# Altium project Mother_Board_SSL2018.PrjPcb
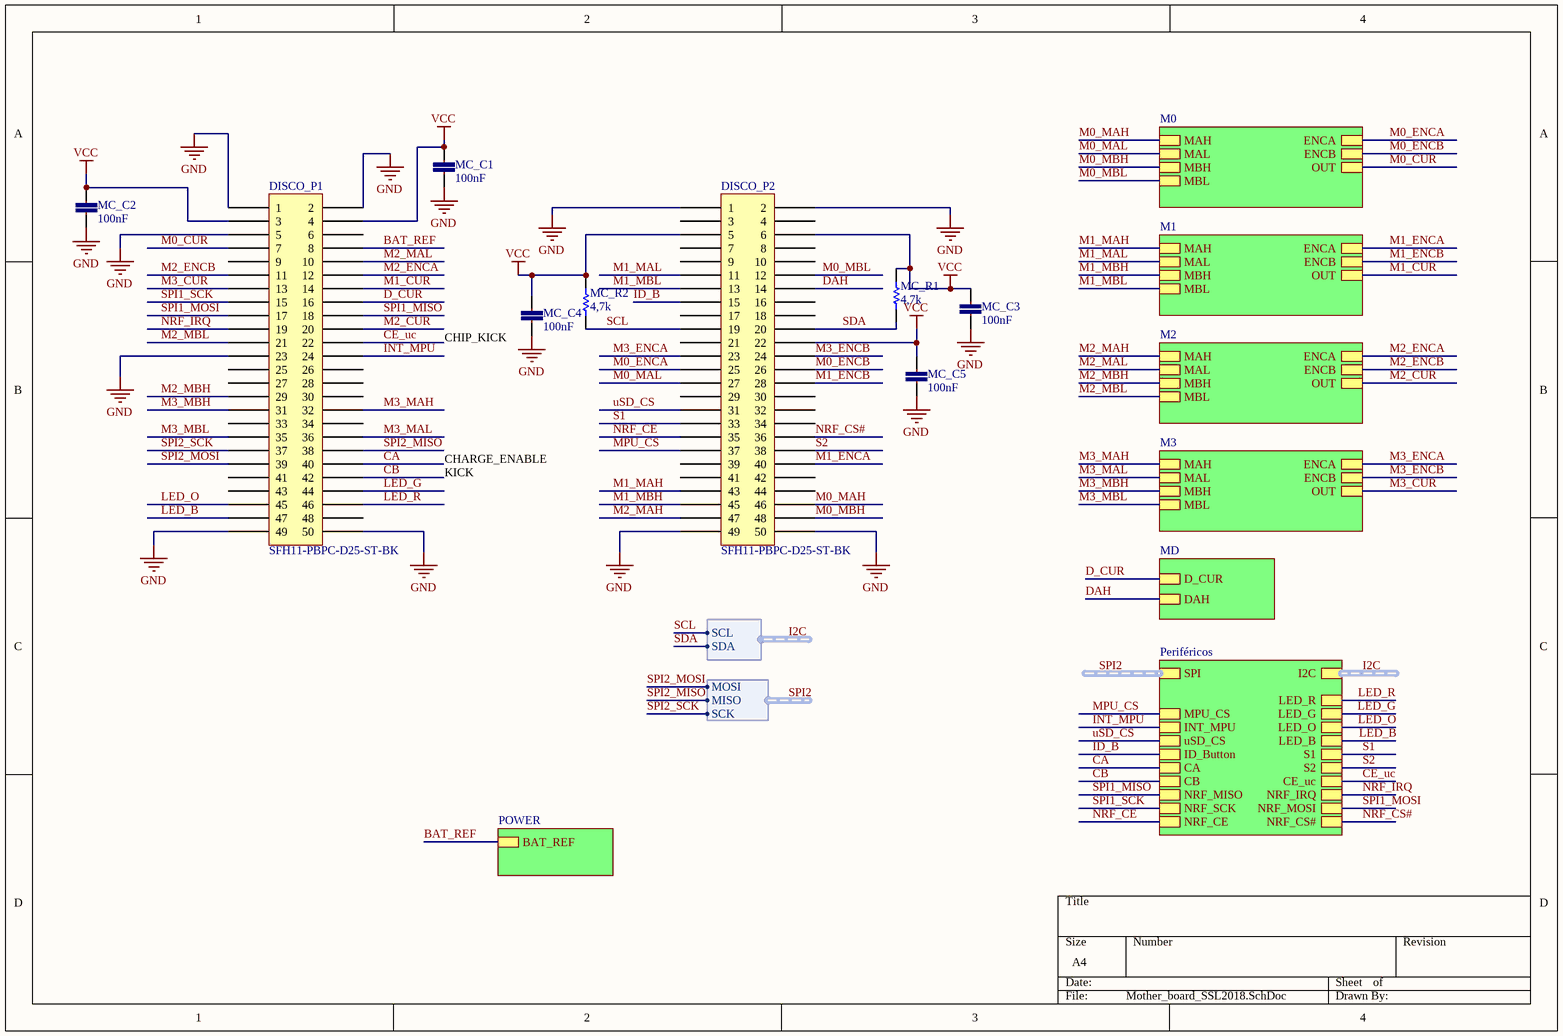
[diagram p0: Mother_board_SSL2018.SchDoc]
6 sheets, 106 parts. Net scope: hierarchical (ports join the sheet entries above them; power ports are global).
Board file: Mother_board_SSL2018.PcbDoc
Sheets:
  Mother_board_SSL2018.SchDoc
    M0 = MOTORES.SchDoc
    POWER = POWER.SchDoc
    M1 = MOTORES.SchDoc
    M2 = MOTORES.SchDoc
    M3 = MOTORES.SchDoc
    Periféricos = Periféricos.SchDoc
    MD = DRIBLE.SchDoc
  INA220.SchDoc

## Sheet Mother_board_SSL2018.SchDoc
size A4

### Parts
DISCO_P1  SFH11-PBPC-D25-ST-BK  [25x02_Conector_Female]
DISCO_P2  SFH11-PBPC-D25-ST-BK  [25x02_Conector_Female]
MC_C1  100nF  [0402-CAP]
MC_C2  100nF  [0402-CAP]
MC_C3  100nF  [0402-CAP]
MC_C4  100nF  [0402-CAP]
MC_C5  100nF  [0402-CAP]
MC_R1  4,7k  [0402]
MC_R2  4,7k  [0402]

### Sub-sheets
M0 = MOTORES.SchDoc: MBH, MAH, MBL, MAL, ENCA, ENCB, OUT
M1 = MOTORES.SchDoc: MBH, MAH, MBL, MAL, ENCA, ENCB, OUT
M2 = MOTORES.SchDoc: MBH, MAH, MBL, MAL, ENCA, ENCB, OUT
M3 = MOTORES.SchDoc: MBH, MAH, MBL, MAL, ENCA, ENCB, OUT
MD = DRIBLE.SchDoc: D_CUR, DAH
Periféricos = Periféricos.SchDoc: MPU_CS, INT_MPU, uSD_CS, LED_R, LED_G, LED_O, LED_B, ID_Button, SPI (harness SPI), I2C (harness I2C), S1, S2, CA, CB, CE_uc, NRF_MISO, NRF_SCK, NRF_CE, NRF_IRQ, NRF_MOSI, NRF_CS#
POWER = POWER.SchDoc: BAT_REF

### Harnesses
I2C: SCL, SDA
SPI: MOSI, MISO, SCK

### Nets
GND: DISCO_P1.1 DISCO_P1.2 DISCO_P1.5 DISCO_P1.23 DISCO_P1.49 DISCO_P1.50 DISCO_P2.1 DISCO_P2.2 DISCO_P2.49 DISCO_P2.50 MC_C1.1 MC_C2.2 MC_C3.1 MC_C4.1 MC_C5.1
VCC: DISCO_P1.3 DISCO_P1.4 DISCO_P2.5 DISCO_P2.6 DISCO_P2.22 MC_C1.2 MC_C2.1 MC_C3.2 MC_C4.2 MC_C5.2 MC_R1.2 MC_R2.2
BAT_REF: DISCO_P1.8 ; sheet POWER/BAT_REF
CA: DISCO_P1.40 ; sheet Periféricos/CA
CB: DISCO_P1.42 ; sheet Periféricos/CB
CE_uc: DISCO_P1.22 ; sheet Periféricos/CE_uc
D_CUR: DISCO_P1.16 ; sheet MD/D_CUR
DAH: DISCO_P2.14 ; sheet MD/DAH
ID_B: DISCO_P2.15 ; sheet Periféricos/ID_Button
INT_MPU: DISCO_P1.24 ; sheet Periféricos/INT_MPU
LED_B: DISCO_P1.47 ; sheet Periféricos/LED_B  [project net Blue_led]
LED_G: DISCO_P1.44 ; sheet Periféricos/LED_G
LED_O: DISCO_P1.45 ; sheet Periféricos/LED_O
LED_R: DISCO_P1.46 ; sheet Periféricos/LED_R
M0_CUR: DISCO_P1.7 ; sheet M0/OUT
M0_ENCA: DISCO_P2.25 ; sheet M0/ENCA
M0_ENCB: DISCO_P2.26 ; sheet M0/ENCB
M0_MAH: DISCO_P2.46 ; sheet M0/MAH
M0_MAL: DISCO_P2.27 ; sheet M0/MAL
M0_MBH: DISCO_P2.48 ; sheet M0/MBH
M0_MBL: DISCO_P2.12 ; sheet M0/MBL
M1_CUR: DISCO_P1.14 ; sheet M1/OUT
M1_ENCA: DISCO_P2.40 ; sheet M1/ENCA
M1_ENCB: DISCO_P2.28 ; sheet M1/ENCB
M1_MAH: DISCO_P2.43 ; sheet M1/MAH
M1_MAL: DISCO_P2.11 ; sheet M1/MAL
M1_MBH: DISCO_P2.45 ; sheet M1/MBH
M1_MBL: DISCO_P2.13 ; sheet M1/MBL
M2_CUR: DISCO_P1.20 ; sheet M2/OUT
M2_ENCA: DISCO_P1.12 ; sheet M2/ENCA
M2_ENCB: DISCO_P1.11 ; sheet M2/ENCB
M2_MAH: DISCO_P2.47 ; sheet M2/MAH
M2_MAL: DISCO_P1.10 ; sheet M2/MAL
M2_MBH: DISCO_P1.29 ; sheet M2/MBH
M2_MBL: DISCO_P1.21 ; sheet M2/MBL
M3_CUR: DISCO_P1.13 ; sheet M3/OUT
M3_ENCA: DISCO_P2.23 ; sheet M3/ENCA
M3_ENCB: DISCO_P2.24 ; sheet M3/ENCB
M3_MAH: DISCO_P1.32 ; sheet M3/MAH
M3_MAL: DISCO_P1.36 ; sheet M3/MAL
M3_MBH: DISCO_P1.31 ; sheet M3/MBH
M3_MBL: DISCO_P1.35 ; sheet M3/MBL
MPU_CS: DISCO_P2.37 ; sheet Periféricos/MPU_CS
NRF_CE: DISCO_P2.35 ; sheet Periféricos/NRF_CE
NRF_CS#: DISCO_P2.36 ; sheet Periféricos/NRF_CS#
NRF_IRQ: DISCO_P1.19 ; sheet Periféricos/NRF_IRQ
S1: DISCO_P2.33 ; sheet Periféricos/S1
S2: DISCO_P2.38 ; sheet Periféricos/S2
SCL: DISCO_P2.19 MC_R2.1 ; sheet Periféricos/I2C.SCL  [project net I2C.SCL]
SDA: DISCO_P2.20 MC_R1.1 ; sheet Periféricos/I2C.SDA  [project net I2C.SDA]
SPI1_MISO: DISCO_P1.18 ; sheet Periféricos/NRF_MISO
SPI1_MOSI: DISCO_P1.17 ; sheet Periféricos/NRF_MOSI
SPI1_SCK: DISCO_P1.15 ; sheet Periféricos/NRF_SCK
SPI2_MISO: DISCO_P1.38 ; sheet Periféricos/SPI.MISO  [project net SPI2.MISO]
SPI2_MOSI: DISCO_P1.39 ; sheet Periféricos/SPI.MOSI  [project net SPI2.MOSI]
SPI2_SCK: DISCO_P1.37 ; sheet Periféricos/SPI.SCK  [project net SPI2.SCK]
uSD_CS: DISCO_P2.31 ; sheet Periféricos/uSD_CS

Not connected (* = marked no-connect by the designer): DISCO_P1 6 9 25 26 27 28 30 33 34 41 43 48; DISCO_P2 3 4 7 8 9 10 16 17 18 21 29 30 32 34 39 41 42 44

### Buses and harness runs
harness I2C = sheet Periféricos/I2C
harness SPI2 = sheet Periféricos/SPI

### Notes on the sheet
- (near MC_C4) CHIP_KICK
- KICK
- CHARGE_ENABLE

### Library data of the parts
DISCO_P1 DISCO_P2 = 25x02_Conector_Female: 50 Position Header Connector 0.100" (2.54mm) Through Hole Gold
MC_C1-MC_C5 = CC0402-100nF-A.12: CAP CER 0.1UF 10V 20% X5R 0402; Part No: VJ0402V104ZXQPBC; Cod EMS: 05.281.006.133; Value: 100n
MC_R1 MC_R2 = Res1: Resistor; Published: 8-Jun-2000; LatestRevisionDate: 17-Jul-2002; LatestRevisionNote: Re-released for DXP Platform.; PackageReference: AXIAL-0.3; Publisher: Altium Limited; PackageDescription: Axial Device, Thru-Hole; 2 Leads; 0.3 in Pin Spacing; Value: 4,7K

## Sheet MOTORES.SchDoc
size A4
Used 4 times, as channels M0, M1, M2, M3. Parts and nets are listed once, with the designators drawn on the sheet.
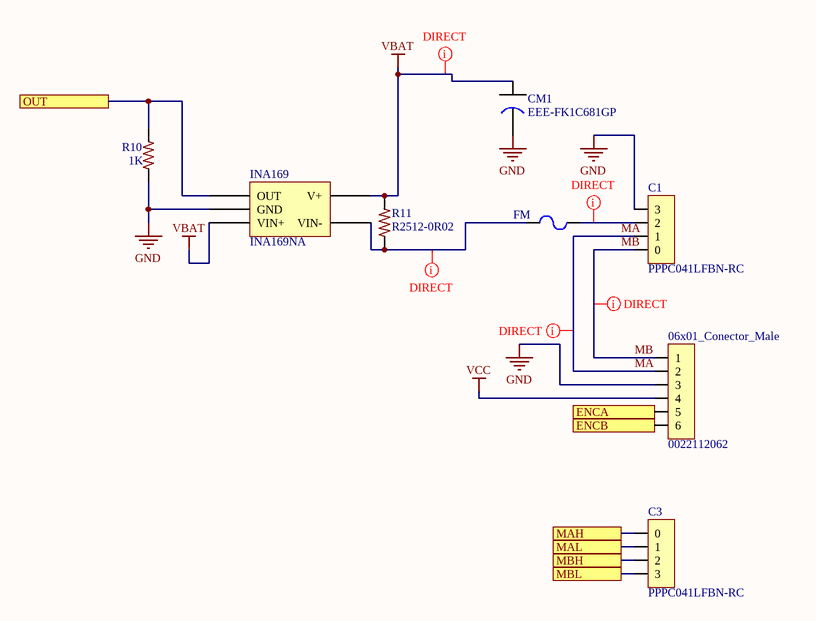
[diagram p1: MOTORES.SchDoc]

### Parts
06x01_Conector_Male  0022112062  [06x01_Conector_Male]
C1  PPPC041LFBN-RC  [04x01_Conector_Female]
C3  PPPC041LFBN-RC  [04x01_Conector_Female]
CM1  EEE-FK1C681GP  [EEE-FK1C681GP]
FM  MF-MSMF250/16X  [RESC4632X16N]  (value not drawn)
INA169  INA169NA  [SOT95P280X125-5N]
R10  1K  [0402-RES-HD]
R11  R2512-0R02  [2512-RES-HD]

### Ports
ENCA, ENCB, MAH, MAL, MBH, MBL, OUT

### Nets
GND: 06x01_Conector_Male.3 C1.3 CM1.2 INA169.2(GND) R10.1
VBAT: CM1.1 INA169.3(VIN+) INA169.4(V+) R11.2
VCC: 06x01_Conector_Male.4
ENCA: 06x01_Conector_Male.5 ; port ENCA
ENCB: 06x01_Conector_Male.6 ; port ENCB
MA: 06x01_Conector_Male.2 C1.1
MAH: C3.0 ; port MAH
MAL: C3.1 ; port MAL
MB: 06x01_Conector_Male.1 C1.0
MBH: C3.2 ; port MBH
MBL: C3.3 ; port MBL
OUT: INA169.1(OUT) R10.2 ; port OUT
NetC1_2: C1.2 FM.1
NetFM_2: FM.2 INA169.5(VIN-) R11.1

### Channels
M0: designators end in _M0; ports ENCA=M0_ENCA ENCB=M0_ENCB MAH=M0_MAH MAL=M0_MAL MBH=M0_MBH MBL=M0_MBL OUT=M0_CUR
M1: designators end in _M1; ports ENCA=M1_ENCA ENCB=M1_ENCB MAH=M1_MAH MAL=M1_MAL MBH=M1_MBH MBL=M1_MBL OUT=M1_CUR
M2: designators end in _M2; ports ENCA=M2_ENCA ENCB=M2_ENCB MAH=M2_MAH MAL=M2_MAL MBH=M2_MBH MBL=M2_MBL OUT=M2_CUR
M3: designators end in _M3; ports ENCA=M3_ENCA ENCB=M3_ENCB MAH=M3_MAH MAL=M3_MAL MBH=M3_MBH MBL=M3_MBL OUT=M3_CUR

### Layout directives
net class DIRECT: MA_M0, MB_M0, NetC1_M0_2, NetFM_M0_2, VBAT

### Library data of the parts
06x01_Conector_Male = 06x01_Conector_Male: CONN HEADER 6POS .100 VERT GOLD
C1 C3 = 04x01_Conector_Female-SCH: 4 Position Header Connector 0.100" (2.54mm) Through Hole Gold
CM1 = CAP AL 680UF/16V: Aluminum Electrolytic Capacitors - SMD Al Lytic Cap SMT FK Series 105C
FM = MF-MSMF250/16X-01.A.1: PTC RESETTABLE .30A 30V 1812
INA169 = INA169NA-01.A.1: IC CURRENT MONITOR 0.5% SOT23-5
R10 = R0402-1K-A.9: RES 1K OHM 1/10W 1% 0402 SMD; Part No: ERJ-2RKF1001X; Cod EMS: 05.280.029.527; Family Description: RESISTOR FILME ESPESSO 10R-1M / 1/10W / 1% / 0402. P/N: ERJ-2RKF....X – PANASONIC ELECTRONIC COMPONENTS.; Value: 1K; Family: ERJ-2RKF....X
R11 = R2512-0R02-4: RES .02 OHM 2W 1% 2512 SMD; Part No: WSL2512R0200FEA18; Cod EMS: 05.280.029.529; Value: 0.02; Family Description: RESISTOR SENTIDO DE CORRENTE 0,010R-0,040R/ 2W / 1% / 2512 P/N: WSL2512.....FEA18 – VISHAY DALE.; Family: WSL2512.....FEA18

## Sheet POWER.SchDoc
size A4
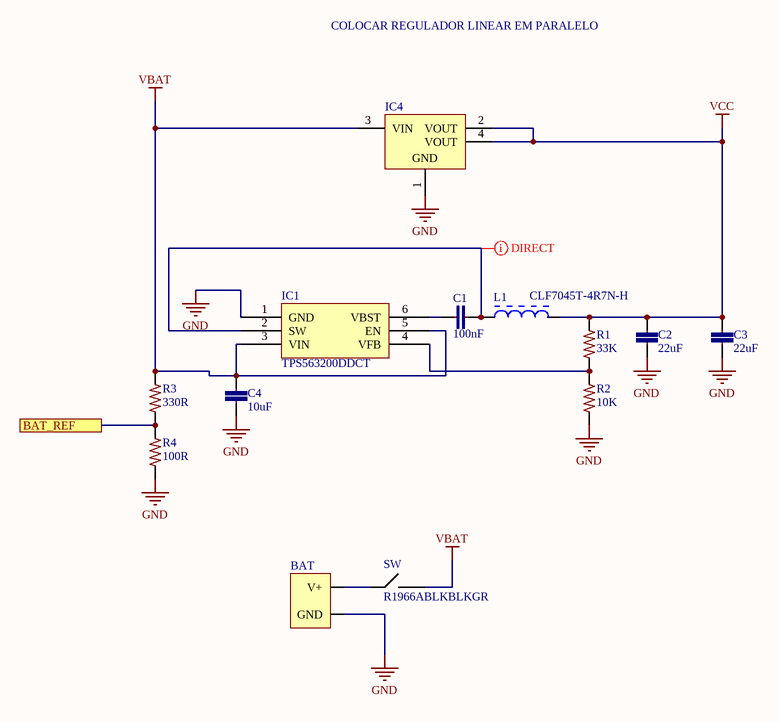
[diagram p2: POWER.SchDoc]

### Parts
(Parts that share a designator on the sheet are numbered #1, #2 ... from top to bottom, then left to right.)
BAT  XT60  [BATTERY_CONECTO-PCB]  (value not drawn)
C1#1  100nF  [0402-CAP]
C2#1  22uF  [1206-CAP]
C3  22uF  [1206-CAP]
C4  10uF  [1210-CAP]
IC1#1  TPS563200DDCT  [SOT95P280X110-6N]
IC4  LD1117S33CTR  [SOT-223_N]  (value not drawn)
L1  CLF7045T-4R7N-H  [CLF7045T]
R1#1  33K  [0402-RES-HD]
R2#1  10K  [0402-RES-HD]
R3#1  330R  [0402-RES-HD]
R4  100R  [0402-RES-HD]
SW  R1966ABLKBLKGR  [R1966AB-PCB]

### Ports
BAT_REF

### Nets
GND: BAT.1(GND) C2#1.1 C3.1 C4.1 IC1#1.1(GND) IC4.1(GND) R2#1.1 R4.1
VBAT: C4.2 IC1#1.3(VIN) IC1#1.5(EN) IC4.3(VIN) R3#1.2 SW.1
VCC: C2#1.2 C3.2 IC4.2(VOUT) IC4.4(VOUT) L1.2 R1#1.2
BAT_REF: R3#1.1 R4.2 ; port BAT_REF
NetBAT_0: BAT.0(V+) SW.0
NetC1#1_1: C1#1.1 IC1#1.6(VBST)
NetC1#1_2: C1#1.2 IC1#1.2(SW) L1.1
NetIC1#1_4: IC1#1.4(VFB) R1#1.1 R2#1.2

### Layout directives
net class DIRECT: NetC1#1_2

### Notes on the sheet
- COLOCAR REGULADOR LINEAR EM PARALELO

### Library data of the parts
BAT = BATTERY_CONNECTOR: XT60 PRT-10474
C1#1 = CC0402-100nF-50v-A.3: CAP CER 0.1UF 50V 10% X7R 0402; Part No: C1005X7R1H104K050BB; Value: 100n; Cod EMS: 05.281.019.021
C2#1 C3 = CC1206-22uF-6.3V-1: CAP CER 22UF 6.3V 20% X5R 1206; Part No: C3216X5R0J226M085AC; Value: 22u; Rule: UNIONINDEX{}0[]RULEKIND{}PolygonConnect[]NETSCOPE{}AnyNet[]LAYERKIND{}SameLayer[]NAME{}Schematic Polygon Connect Style[]CONNECTSTYLE{}Direct[]RELIEFCONDUCTORWIDTH{}10mil[]RELIEFENTRIES{}4[]POLYGONRELIEFANGLE{}45 Angle[]AIRGAPWIDTH{}10mil[]UNIT{}Imperial[]PcbType{}ProtelPcb
C4 = CC1210-10uF-6: CAP CER 10UF 50V 20% X5R 1210; Part No: UMK325BJ106MM; value: 10u; Cod EMS: 05.281.019.522
IC1#1 = TPS563200DDCT-01.A.2: IC REG BUCK ADJ 3A SYNC 6SOT
IC4 = CMP-0244-00307-1: Fixed Low Drop Positive Voltage Regulator, 3.3V, 4-Pin SOT-223, Tape and Reel; ComponentLink1URL: http://www.st.com; PackageVersion: 2010; ComponentLink1Description: Manufacturer URL; DatasheetVersion: 1/11/2011; ComponentLink2URL: http://www.st.com/internet/com/TECHNICAL_RESOURCES/TECHNICAL_LITERATURE/DATASHEET/CD00000544.pdf; PackageReference: SOT-223; ComponentLink2Description: Datasheet; PackageDescription: 4-Pin SOT-223 Package, 6.5 x 3.5 mm Body, 2.3 mm Pitch, 7 mm Lead Span
L1 = CLF7045T-4R7N-H-2: FIXED IND 4.7UH 4.1A 20 MOHM SMD; Family Description: INDUTORES FIXOS 7,2x6,9mm TDK CLF7045T -45 A 125oC; Rule: UNIONINDEX{}0[]RULEKIND{}PolygonConnect[]NETSCOPE{}AnyNet[]LAYERKIND{}SameLayer[]NAME{}Schematic Polygon Connect Style[]CONNECTSTYLE{}Direct[]RELIEFCONDUCTORWIDTH{}10mil[]RELIEFENTRIES{}4[]POLYGONRELIEFANGLE{}45 Angle[]AIRGAPWIDTH{}10mil[]UNIT{}Imperial[]PcbType{}ProtelPcb; Part No: CLF7045T-4R7N-H; Family: CLF7045T
R1#1 = R0402-33K-7: RES 33K OHM 1/10W 1% 0402 SMD; Part No: ERJ-2RKF3302X; Family Description: RESISTOR FILME ESPESSO 10R-1M / 1/10W / 1% / 0402. P/N: ERJ-2RKF....X – PANASONIC ELECTRONIC COMPONENTS.; Cod EMS: 05.280.029.535; Value: 33K; Family: ERJ-2RKF....X
R2#1 = R0402-10K-10: RES 10K OHM 1/10W 1% 0402 SMD; Part No: ERJ-2RKF1002X; Cod EMS: 05.280.029.525; Family Description: RESISTOR FILME ESPESSO 10R-1M / 1/10W / 1% / 0402. P/N: ERJ-2RKF....X – PANASONIC ELECTRONIC COMPONENTS.; Value: 10K; Family: ERJ-2RKF....X
R3#1 = R0402-10K-10: RES 330R OHM 1/10W 1% 0402 SMD; Part No: ERJ-2RKF1002X; Cod EMS: 05.280.029.525; Value: 330; Family Description: RESISTOR FILME ESPESSO 10R-1M / 1/10W / 1% / 0402. P/N: ERJ-2RKF....X – PANASONIC ELECTRONIC COMPONENTS.; Family: ERJ-2RKF....X
R4 = R0402-33K-7: RES 100R OHM 1/10W 1% 0402 SMD; Part No: ERJ-2RKF3302X; Cod EMS: 05.280.029.535; Value: 100; Family Description: RESISTOR FILME ESPESSO 10R-1M / 1/10W / 1% / 0402. P/N: ERJ-2RKF....X – PANASONIC ELECTRONIC COMPONENTS.; Family: ERJ-2RKF....X
SW = Rocker Switch: SWITCH ROCKER SPST 15A 125V

## Sheet Periféricos.SchDoc
size A4
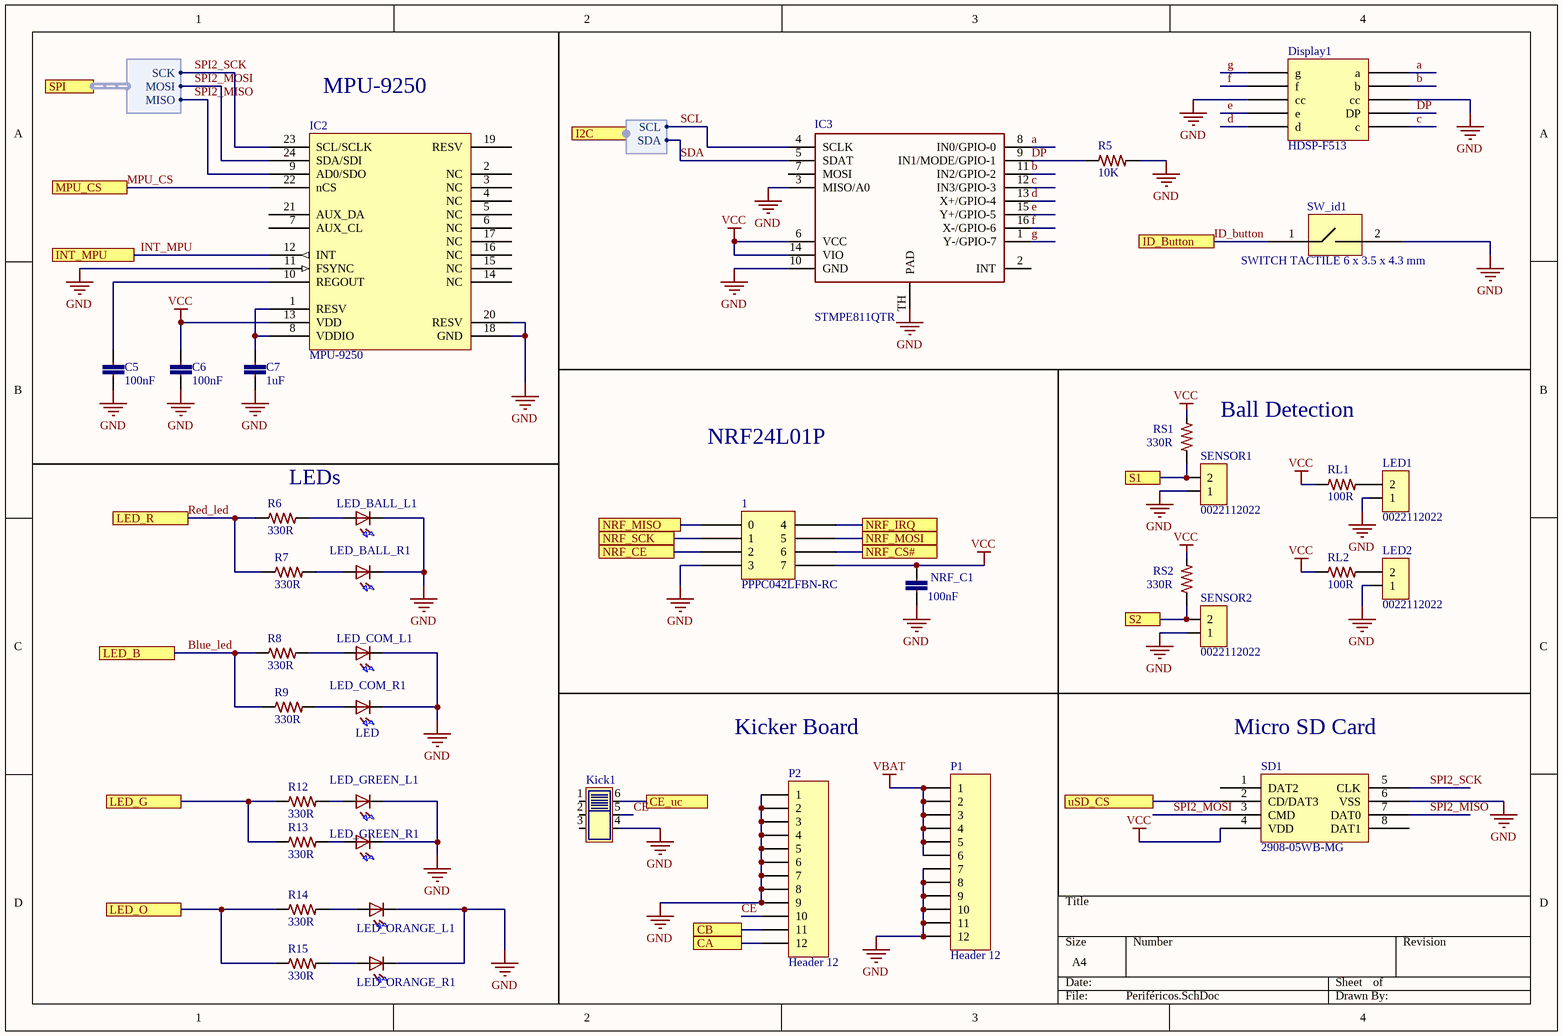
[diagram p3: Periféricos.SchDoc]

### Parts
1  PPPC042LFBN-RC  [04x02_Conector_Female]
C5  100nF  [0402-CAP]
C6  100nF  [0402-CAP]
C7  1uF  [0402-CAP]
Display1  HDSP-F513  [New footprint 1]
IC2  MPU-9250  [MPU-9250]
IC3  STMPE811QTR  [QFN16_N]
Kick1  JS202011SCQN  [SOP250P750X350-6N]  (value not drawn)
LED1  0022112022  [02x01_Conector_Male]
LED2  0022112022  [02x01_Conector_Male]
LED_BALL_L1  LED  [LED-5MM-PCB]  (value not drawn)
LED_BALL_R1  LED  [LED-5MM-PCB]  (value not drawn)
LED_COM_L1  LED  [LED-5MM-PCB]  (value not drawn)
LED_COM_R1  LED  [LED-5MM-PCB]
LED_GREEN_L1  LED  [LED-5MM-PCB]  (value not drawn)
LED_GREEN_R1  LED  [LED-5MM-PCB]  (value not drawn)
LED_ORANGE_L1  LED  [LED-5MM-PCB]  (value not drawn)
LED_ORANGE_R1  LED  [LED-5MM-PCB]  (value not drawn)
NRF_C1  100nF  [0402-CAP]
P1  Header 12  [HDR1X12]
P2  Header 12  [HDR1X12]
R5  10K  [0402-RES-HD]
R6  330R  [0402-RES-HD]
R7  330R  [0402-RES-HD]
R8  330R  [0402-RES-HD]
R9  330R  [0402-RES-HD]
R12  330R  [0402-RES-HD]
R13  330R  [0402-RES-HD]
R14  330R  [0402-RES-HD]
R15  330R  [0402-RES-HD]
RL1  100R  [0402-RES-HD]
RL2  100R  [0402-RES-HD]
RS1  330R  [0402-RES-HD]
RS2  330R  [0402-RES-HD]
SD1  2908-05WB-MG  [New footprint 1]
SENSOR1  0022112022  [02x01_Conector_Male]
SENSOR2  0022112022  [02x01_Conector_Male]
SW_id1  SWITCH TACTILE 6 x 3.5 x 4.3 mm  [PCBComponent]

### Ports
CA, CB, CE_uc, I2C (harness I2C), ID_Button, INT_MPU, LED_B, LED_G, LED_O, LED_R, MPU_CS, NRF_CE, NRF_CS#, NRF_IRQ, NRF_MISO, NRF_MOSI, NRF_SCK, S1, S2, SPI (harness SPI), uSD_CS

### Harnesses
SPI: MOSI, MISO, SCK
I2C: SCL, SDA

### Nets
GND: 1.3 C5.2 C6.2 C7.2 Display1.3(cc) Display1.8(cc) IC2.11(FSYNC) IC2.18(GND) IC2.20(RESV) IC3.3(MISO/A0) IC3.10(GND) IC3.TH(PAD) Kick1.4 LED1.1 LED2.1 LED_BALL_L1.1(K) LED_BALL_R1.1(K) LED_COM_L1.1(K) LED_COM_R1.1(K) LED_GREEN_L1.1(K) LED_GREEN_R1.1(K) LED_ORANGE_L1.1(K) LED_ORANGE_R1.1(K) NRF_C1.2 P1.7 P1.8 P1.9 P1.10 P1.11 P1.12 P2.1 P2.2 P2.3 P2.4 P2.5 P2.6 P2.7 P2.8 P2.9 R5.2 SD1.6(VSS) SENSOR1.1 SENSOR2.1 SW_id1.2
VBAT: P1.1 P1.2 P1.3 P1.4 P1.5 P1.6
VCC: 1.7 C6.1 IC2.13(VDD) IC3.6(VCC) IC3.14(VIO) NRF_C1.1 RL1.1 RL2.1 RS1.2 RS2.2 SD1.4(VDD)
a: Display1.6(a) IC3.8(IN0/GPIO-0)
b: Display1.7(b) IC3.11(IN2/GPIO-2)
Blue_led: R8.1 R9.1 ; port LED_B
c: Display1.10(c) IC3.12(IN3/GPIO-3)
CA: P2.12 ; port CA
CB: P2.11 ; port CB
CE: Kick1.5 P2.10
CE_uc: Kick1.6 ; port CE_uc
d: Display1.5(d) IC3.13(X+/GPIO-4)
DP: Display1.9(DP) IC3.9(IN1/MODE/GPIO-1) R5.1
e: Display1.4(e) IC3.15(Y+/GPIO-5)
f: Display1.2(f) IC3.16(X-/GPIO-6)
g: Display1.1(g) IC3.1(Y-/GPIO-7)
ID_button: SW_id1.1 ; port ID_Button  [project net ID_B]
INT_MPU: IC2.12(INT) ; port INT_MPU
LED_G: R12.1 R13.1 ; port LED_G
LED_O: R14.1 R15.1 ; port LED_O
MPU_CS: IC2.22(nCS) ; port MPU_CS
NRF_CE: 1.2 ; port NRF_CE
NRF_CS#: 1.6 ; port NRF_CS#
NRF_IRQ: 1.4 ; port NRF_IRQ
Red_led: R6.1 R7.1 ; port LED_R  [project net LED_R]
S1: RS1.1 SENSOR1.2 ; port S1
S2: RS2.1 SENSOR2.2 ; port S2
SCL: IC3.4(SCLK) ; port I2C.SCL  [project net I2C.SCL]
SDA: IC3.5(SDAT) ; port I2C.SDA  [project net I2C.SDA]
SPI1_MISO: 1.0 ; port NRF_MISO
SPI1_MOSI: 1.5 ; port NRF_MOSI
SPI1_SCK: 1.1 ; port NRF_SCK
SPI2_MISO: IC2.9(AD0/SDO) SD1.7(DAT0) ; port SPI.MISO  [project net SPI2.MISO]
SPI2_MOSI: IC2.24(SDA/SDI) SD1.3(CMD) ; port SPI.MOSI  [project net SPI2.MOSI]
SPI2_SCK: IC2.23(SCL/SCLK) SD1.5(CLK) ; port SPI.SCK  [project net SPI2.SCK]
uSD_CS: SD1.2(CD/DAT3) ; port uSD_CS
NetC5_1: C5.1 IC2.10(REGOUT)
NetC7_1: C7.1 IC2.1(RESV) IC2.8(VDDIO)
NetLED1_2: LED1.2 RL1.2
NetLED2_2: LED2.2 RL2.2
NetLED_BALL_L1_2: LED_BALL_L1.2(A) R6.2
NetLED_BALL_R1_2: LED_BALL_R1.2(A) R7.2
NetLED_COM_L1_2: LED_COM_L1.2(A) R8.2
NetLED_COM_R1_2: LED_COM_R1.2(A) R9.2
NetLED_GREEN_L1_2: LED_GREEN_L1.2(A) R12.2
NetLED_GREEN_R1_2: LED_GREEN_R1.2(A) R13.2
NetLED_ORANGE_L1_2: LED_ORANGE_L1.2(A) R14.2
NetLED_ORANGE_R1_2: LED_ORANGE_R1.2(A) R15.2

Not connected (* = marked no-connect by the designer): IC2 2(NC) 3(NC) 4(NC) 5(NC) 6(NC) 7(AUX_CL) 14(NC) 15(NC) 16(NC) 17(NC) 19(RESV) 21(AUX_DA); IC3 2(INT) 7(MOSI); Kick1 1 2 3; SD1 1(DAT2) 8(DAT1)

### Notes on the sheet
- (near IC2) MPU-9250
- NRF24L01P
- (near RS1) Ball Detection
- LEDs
- Kicker Board
- (near SD1) Micro SD Card

### Library data of the parts
1 = 04x02_Conector_Female: 8 Position Header Connector 0.100" (2.54mm) Through Hole Gold
C5 C6 NRF_C1 = CC0402-100nF-A.12: as MC_C1 on sheet Mother_board_SSL2018
C7 = CC0402-1uF-5: CAP CER 1UF 6.3V 10% X5R 0402; Part No: JMK105BJ105KV-F; Cod EMS: 05.281.019.513; Value: 1u
Display1 = HDSP-F513-01.A.2: 7 segments display
IC2 = MPU-9250-1: IMU ACCEL/GYRO/MAG I2C/SPI 24QFN; Part No: MPU-9250
IC3 = STMPE811QTR-6: IC TSC I/O EXPAND 8B 16QFN; Cod EMS: 05.284.001.511; Part No: STMPE811QTR
Kick1 = JS202011SCQN-1: SWITCH SLIDE DPDT 300MA 6V; Part No: JS202011SCQN
LED1 LED2 SENSOR1 SENSOR2 = 02x01_Conector_Male: CONN HEADER 2POS .100 VERT GOLD
LED_BALL_L1 LED_BALL_R1 LED_COM_L1 LED_COM_R1 LED_GREEN_L1 LED_GREEN_R1 LED_ORANGE_L1 LED_ORANGE_R1 = LED-5MM-3: LED 5MM PTH
P1 P2 = Header 12: Header, 12-Pin; LatestRevisionDate: 17-Jul-2002; LatestRevisionNote: Re-released for DXP Platform.; Publisher: Altium Limited
R5 = R0402-10K-11: RES 10K OHM 1/10W 1% 0402 SMD; Part No: ERJ-2RKF1002X; Cod EMS: 05.280.029.525; Family Description: RESISTOR FILME ESPESSO 10R-1M / 1/10W / 1% / 0402. P/N: ERJ-2RKF....X – PANASONIC ELECTRONIC COMPONENTS.; Value: 10K; Family: ERJ-2RKF....X
R6-R9 R12-R15 = R0402-330R-7: RES 330 OHM 1/10W 1% 0402 SMD; Part No: ERJ-2RKF3300X; Cod EMS: 05.280.029.506; Value: 330; Family Description: RESISTOR FILME ESPESSO 10R-1M / 1/10W / 1% / 0402. P/N: ERJ-2RKF....X – PANASONIC ELECTRONIC COMPONENTS.; Family: ERJ-2RKF....X
RL1 RL2 = R0402-100R-5: RES 100 OHM 1/10W 1% 0402 SMD; Part No: ERJ-2RKF1000X; Value: 100; Cod EMS: 05.280.029.519; Family Description: RESISTOR FILME ESPESSO 10R-1M / 1/10W / 1% / 0402. P/N: ERJ-2RKF....X – PANASONIC ELECTRONIC COMPONENTS.; Family: ERJ-2RKF....X
RS1 RS2 = R0402-330R-7: RES 330 OHM 1/10W 1% 0402 SMD; Part No: ERJ-2RKF3300X; Value: 330; Cod EMS: 05.280.029.506; Family Description: RESISTOR FILME ESPESSO 10R-1M / 1/10W / 1% / 0402. P/N: ERJ-2RKF....X – PANASONIC ELECTRONIC COMPONENTS.; Family: ERJ-2RKF....X
SD1 = 2908-05WB-MG-01.A.1: CONN MICRO SD CARD PUSH-PUSH R/A
SW_id1 = 95C04A3GWRT.-1: GRAYHILL TACT,GW,6X3.5,1800T&R,LF Eight, 160g Operating Force, Gull Wing, RoHS Compliant; Part No: 95C04A3GWRT

## Sheet DRIBLE.SchDoc
size A4
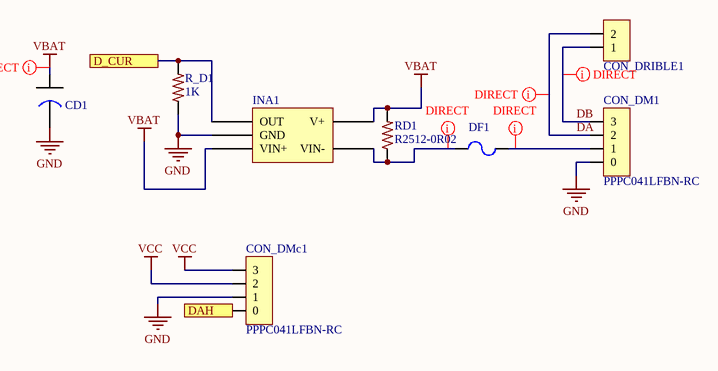
[diagram p4: DRIBLE.SchDoc]

### Parts
CD1  EEE-FK1C681GP  [EEE-FK1C681GP]  (value not drawn)
CON_DM1  PPPC041LFBN-RC  [04x01_Conector_Female - duplicate]
CON_DMc1  PPPC041LFBN-RC  [04x01_Conector_Female - duplicate]
CON_DRIBLE1  0022112022  [02x01_Conector_Male]  (value not drawn)
DF1  MF-MSMF250/16X  [RESC4632X16N]  (value not drawn)
INA1  INA169NA  [SOT95P280X125-5N]  (value not drawn)
R_D1  1K  [0402-RES-HD]
RD1  R2512-0R02  [2512-RES-HD]

### Ports
D_CUR, DAH

### Nets
GND: CD1.2 CON_DM1.0 CON_DMc1.1 INA1.2(GND) R_D1.1
VBAT: CD1.1 INA1.3(VIN+) INA1.4(V+) RD1.2
VCC: CON_DMc1.2 CON_DMc1.3
D_CUR: INA1.1(OUT) R_D1.2 ; port D_CUR
DA: CON_DM1.2 CON_DRIBLE1.2
DAH: CON_DMc1.0 ; port DAH
DB: CON_DM1.3 CON_DRIBLE1.1
NetCON_DM1_1: CON_DM1.1 DF1.1
NetDF1_2: DF1.2 INA1.5(VIN-) RD1.1

### Layout directives
net class DIRECT: DA, DB, NetCON_DM1_1, NetDF1_2, VBAT

### Library data of the parts
CD1 = CAP AL 680UF/16V: as CM1 on sheet MOTORES
CON_DM1 CON_DMc1 = 04x01_Conector_Female-SCH: as C1 on sheet MOTORES
CON_DRIBLE1 = 02x01_Conector_Male: CONN HEADER 2POS .100 VERT GOLD
DF1 = MF-MSMF250/16X-01.A.1: PTC RESETTABLE .30A 30V 1812
INA1 = INA169NA-01.A.1: IC CURRENT MONITOR 0.5% SOT23-5
R_D1 = R0402-1K-A.9: as R10 on sheet MOTORES; Value: 1K; Family: ERJ-2RKF....X
RD1 = R2512-0R02-4: as R11 on sheet MOTORES; Family: WSL2512.....FEA18

## Sheet INA220.SchDoc
size A4; Organization1: VINCULADA AO EXÉRCITO BRASILEIRO; Organization2: FÁBRICA DE MATERIAL DE; Organization3: COMUNICAÇÕES E ELETRÔNICA; Organization0: INDÚSTRIA DE MATERIAL BÉLICO DO BRASIL
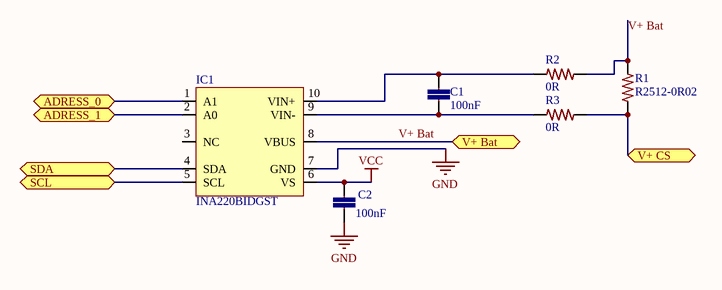
[diagram p5: INA220.SchDoc]

### Parts
(Parts that share a designator on the sheet are numbered #1, #2 ... from top to bottom, then left to right.)
C1#2  100nF  [0402-CAP]
C2#2  100nF  [0402-CAP]
IC1#2  INA220BIDGST  [TSSOP10]
R1#2  R2512-0R02  [2512-RES-HD]
R2#2  0R  [0402-RES-HD]
R3#2  0R  [0402-RES-HD]

### Ports
ADRESS_0, ADRESS_1, SCL, SDA, V+ Bat, V+ CS

### Nets
GND: C2#2.2 IC1#2.7(GND)
VCC: C2#2.1 IC1#2.6(VS)
V+ Bat: IC1#2.8(VBUS) R1#2.2 R2#2.2 ; port V+ Bat
NetC1#2_1: C1#2.1 IC1#2.10(VIN+) R2#2.1
NetC1#2_2: C1#2.2 IC1#2.9(VIN-) R3#2.1
NetIC1#2_1: IC1#2.1(A1) ; port ADRESS_0
NetIC1#2_2: IC1#2.2(A0) ; port ADRESS_1
NetIC1#2_4: IC1#2.4(SDA) ; port SDA
NetIC1#2_5: IC1#2.5(SCL) ; port SCL
NetR1#2_1: R1#2.1 R3#2.2 ; port V+ CS

Not connected (* = marked no-connect by the designer): IC1#2 3(NC)

### Notes on the sheet
- USADO EQUIP.:
- DATA:
- ENG:
- HORA:
- APROV._______
- REV:
- TÍTULO:
- FOLHA:
- /
- FORMATO:
- A4
- CÓDIGO:
- ESTOQUE:

### Library data of the parts
C1#2 C2#2 = CC0402-100nF-A.12: as MC_C1 on sheet Mother_board_SSL2018
IC1#2 = INA220BIDGST-3: IC MONITOR PWR/CURR BIDIR 10MSOP; Cod EMS: 05.284.001.527; Part No: INA220BIDGST
R1#2 = R2512-0R02-4: as R11 on sheet MOTORES; Family: WSL2512.....FEA18
R2#2 R3#2 = R0402-0R-7: RES 0.0 OHM 1/16W JUMP 0402 SMD; Part No: CRCW04020000Z0ED; Cod EMS: 05.280.029.528; Value: 0

## Nets that join several sheets
GND: Mother_board_SSL2018 (15 pins), M0 (5 pins), POWER (8 pins), M1 (5 pins), M2 (5 pins), M3 (5 pins), Periféricos (44 pins), DRIBLE (5 pins), INA220 (C2#2.2 IC1#2.7)
VBAT: M0 (CM1_M0.1 INA169_M0.3 INA169_M0.4 R11_M0.2), POWER (6 pins), M1 (CM1_M1.1 INA169_M1.3 INA169_M1.4 R11_M1.2), M2 (CM1_M2.1 INA169_M2.3 INA169_M2.4 R11_M2.2), M3 (CM1_M3.1 INA169_M3.3 INA169_M3.4 R11_M3.2), Periféricos (6 pins), DRIBLE (CD1.1 INA1.3 INA1.4 RD1.2)
VCC: Mother_board_SSL2018 (12 pins), M0 (06x01_Conector_Male_M0.4), POWER (6 pins), M1 (06x01_Conector_Male_M1.4), M2 (06x01_Conector_Male_M2.4), M3 (06x01_Conector_Male_M3.4), Periféricos (11 pins), DRIBLE (CON_DMc1.2 CON_DMc1.3), INA220 (C2#2.1 IC1#2.6)
BAT_REF: Mother_board_SSL2018 (DISCO_P1.8), POWER (R3#1.1 R4.2)
Blue_led: Mother_board_SSL2018 (DISCO_P1.47), Periféricos (R8.1 R9.1)
CA: Mother_board_SSL2018 (DISCO_P1.40), Periféricos (P2.12)
CB: Mother_board_SSL2018 (DISCO_P1.42), Periféricos (P2.11)
CE_uc: Mother_board_SSL2018 (DISCO_P1.22), Periféricos (Kick1.6)
D_CUR: Mother_board_SSL2018 (DISCO_P1.16), DRIBLE (INA1.1 R_D1.2)
DAH: Mother_board_SSL2018 (DISCO_P2.14), DRIBLE (CON_DMc1.0)
I2C.SCL: Mother_board_SSL2018 (DISCO_P2.19 MC_R2.1), Periféricos (IC3.4)
I2C.SDA: Mother_board_SSL2018 (DISCO_P2.20 MC_R1.1), Periféricos (IC3.5)
ID_B: Mother_board_SSL2018 (DISCO_P2.15), Periféricos (SW_id1.1)
INT_MPU: Mother_board_SSL2018 (DISCO_P1.24), Periféricos (IC2.12)
LED_G: Mother_board_SSL2018 (DISCO_P1.44), Periféricos (R12.1 R13.1)
LED_O: Mother_board_SSL2018 (DISCO_P1.45), Periféricos (R14.1 R15.1)
LED_R: Mother_board_SSL2018 (DISCO_P1.46), Periféricos (R6.1 R7.1)
M0_CUR: Mother_board_SSL2018 (DISCO_P1.7), M0 (INA169_M0.1 R10_M0.2)
M0_ENCA: Mother_board_SSL2018 (DISCO_P2.25), M0 (06x01_Conector_Male_M0.5)
M0_ENCB: Mother_board_SSL2018 (DISCO_P2.26), M0 (06x01_Conector_Male_M0.6)
M0_MAH: Mother_board_SSL2018 (DISCO_P2.46), M0 (C3_M0.0)
M0_MAL: Mother_board_SSL2018 (DISCO_P2.27), M0 (C3_M0.1)
M0_MBH: Mother_board_SSL2018 (DISCO_P2.48), M0 (C3_M0.2)
M0_MBL: Mother_board_SSL2018 (DISCO_P2.12), M0 (C3_M0.3)
M1_CUR: Mother_board_SSL2018 (DISCO_P1.14), M1 (INA169_M1.1 R10_M1.2)
M1_ENCA: Mother_board_SSL2018 (DISCO_P2.40), M1 (06x01_Conector_Male_M1.5)
M1_ENCB: Mother_board_SSL2018 (DISCO_P2.28), M1 (06x01_Conector_Male_M1.6)
M1_MAH: Mother_board_SSL2018 (DISCO_P2.43), M1 (C3_M1.0)
M1_MAL: Mother_board_SSL2018 (DISCO_P2.11), M1 (C3_M1.1)
M1_MBH: Mother_board_SSL2018 (DISCO_P2.45), M1 (C3_M1.2)
M1_MBL: Mother_board_SSL2018 (DISCO_P2.13), M1 (C3_M1.3)
M2_CUR: Mother_board_SSL2018 (DISCO_P1.20), M2 (INA169_M2.1 R10_M2.2)
M2_ENCA: Mother_board_SSL2018 (DISCO_P1.12), M2 (06x01_Conector_Male_M2.5)
M2_ENCB: Mother_board_SSL2018 (DISCO_P1.11), M2 (06x01_Conector_Male_M2.6)
M2_MAH: Mother_board_SSL2018 (DISCO_P2.47), M2 (C3_M2.0)
M2_MAL: Mother_board_SSL2018 (DISCO_P1.10), M2 (C3_M2.1)
M2_MBH: Mother_board_SSL2018 (DISCO_P1.29), M2 (C3_M2.2)
M2_MBL: Mother_board_SSL2018 (DISCO_P1.21), M2 (C3_M2.3)
M3_CUR: Mother_board_SSL2018 (DISCO_P1.13), M3 (INA169_M3.1 R10_M3.2)
M3_ENCA: Mother_board_SSL2018 (DISCO_P2.23), M3 (06x01_Conector_Male_M3.5)
M3_ENCB: Mother_board_SSL2018 (DISCO_P2.24), M3 (06x01_Conector_Male_M3.6)
M3_MAH: Mother_board_SSL2018 (DISCO_P1.32), M3 (C3_M3.0)
M3_MAL: Mother_board_SSL2018 (DISCO_P1.36), M3 (C3_M3.1)
M3_MBH: Mother_board_SSL2018 (DISCO_P1.31), M3 (C3_M3.2)
M3_MBL: Mother_board_SSL2018 (DISCO_P1.35), M3 (C3_M3.3)
MPU_CS: Mother_board_SSL2018 (DISCO_P2.37), Periféricos (IC2.22)
NRF_CE: Mother_board_SSL2018 (DISCO_P2.35), Periféricos (1.2)
NRF_CS#: Mother_board_SSL2018 (DISCO_P2.36), Periféricos (1.6)
NRF_IRQ: Mother_board_SSL2018 (DISCO_P1.19), Periféricos (1.4)
S1: Mother_board_SSL2018 (DISCO_P2.33), Periféricos (RS1.1 SENSOR1.2)
S2: Mother_board_SSL2018 (DISCO_P2.38), Periféricos (RS2.1 SENSOR2.2)
SPI1_MISO: Mother_board_SSL2018 (DISCO_P1.18), Periféricos (1.0)
SPI1_MOSI: Mother_board_SSL2018 (DISCO_P1.17), Periféricos (1.5)
SPI1_SCK: Mother_board_SSL2018 (DISCO_P1.15), Periféricos (1.1)
SPI2.MISO: Mother_board_SSL2018 (DISCO_P1.38), Periféricos (IC2.9 SD1.7)
SPI2.MOSI: Mother_board_SSL2018 (DISCO_P1.39), Periféricos (IC2.24 SD1.3)
SPI2.SCK: Mother_board_SSL2018 (DISCO_P1.37), Periféricos (IC2.23 SD1.5)
uSD_CS: Mother_board_SSL2018 (DISCO_P2.31), Periféricos (SD1.2)